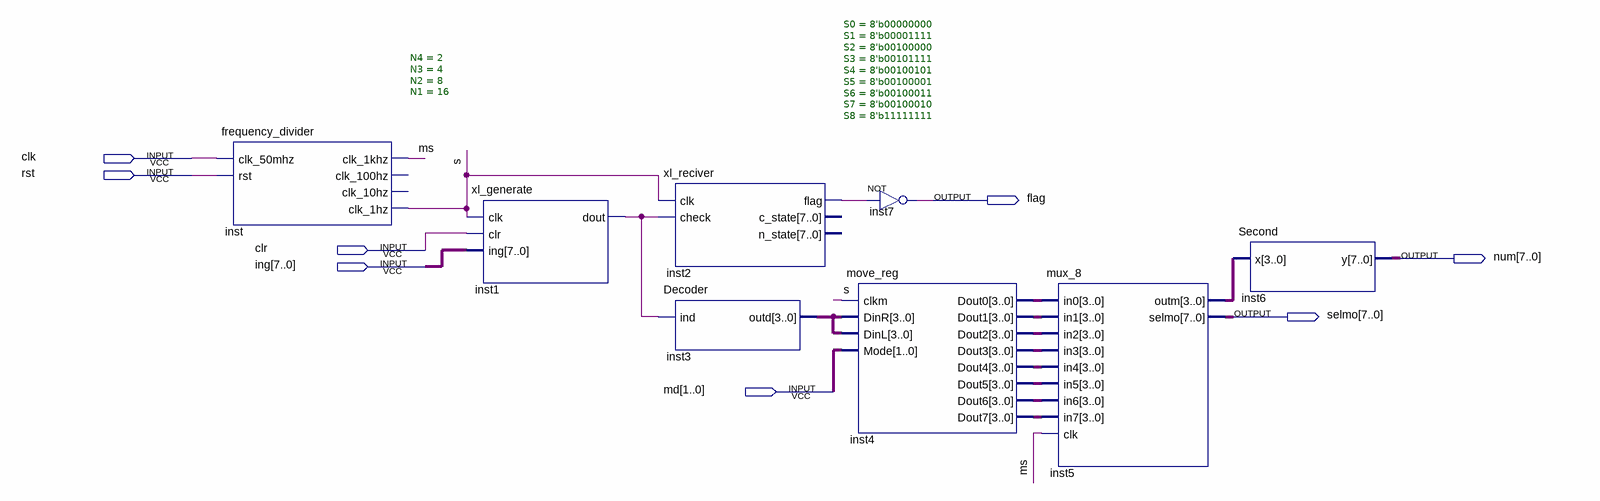
[diagram p0: schematic sheet]
// Quartus schematic NinthProject_00.bdf as structural Verilog: 8 symbols, 8 pins
module NinthProject_00 (
  input  clk,
  input  rst,
  input  clr,
  input  [7:0] ing,
  input  [1:0] md,
  output flag,
  output [7:0] num,
  output [7:0] selmo
);

  wire inst1_dout, inst2_flag, ms, s;
  wire [3:0] inst3_outd, inst4_dout0, inst4_dout1, inst4_dout2, inst4_dout3, inst4_dout4, inst4_dout5,
       inst4_dout6, inst4_dout7, inst5_outm;

  frequency_divider #(.N4(2), .N3(4), .N2(8), .N1(16)) inst (
    .clk_50mhz(clk), .rst(rst), .clk_1khz(ms), .clk_1hz(s));  // open: clk_100hz, clk_10hz
  xl_generate inst1 (.clk(s), .clr(clr), .ing(ing), .dout(inst1_dout));
  xl_reciver #(.S0(8'b00000000), .S1(8'b00001111), .S2(8'b00100000), .S3(8'b00101111), .S4(8'b00100101), .S5(8'b00100001), .S6(8'b00100011), .S7(8'b00100010), .S8(8'b11111111)) inst2 (
    .clk(s), .check(inst1_dout), .flag(inst2_flag));  // open: c_state, n_state
  Decoder inst3 (.ind(inst1_dout), .outd(inst3_outd));
  move_reg inst4 (
    .clkm(s), .DinR(inst3_outd), .DinL(inst3_outd), .Mode(md), .Dout0(inst4_dout0), .Dout1(inst4_dout1),
    .Dout2(inst4_dout2), .Dout3(inst4_dout3), .Dout4(inst4_dout4), .Dout5(inst4_dout5), .Dout6(inst4_dout6),
    .Dout7(inst4_dout7));
  not inst7 (flag, inst2_flag);
  mux_8 inst5 (
    .in0(inst4_dout0), .in1(inst4_dout1), .in2(inst4_dout2), .in3(inst4_dout3), .in4(inst4_dout4),
    .in5(inst4_dout5), .in6(inst4_dout6), .in7(inst4_dout7), .clk(ms), .outm(inst5_outm), .selmo(selmo));
  Second inst6 (.x(inst5_outm), .y(num));
endmodule
